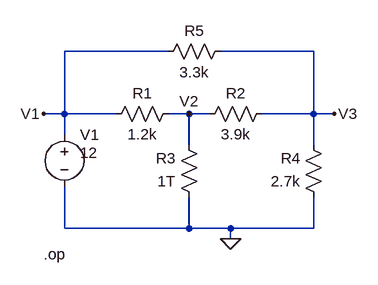
[diagram p0: schematic nodal8.asc]
nodal8.asc, the LTspice schematic file:
Version 4
SHEET 1 880 680
WIRE 144 16 -16 16
WIRE 368 16 224 16
WIRE -16 112 -16 16
WIRE -16 112 -48 112
WIRE 64 112 -16 112
WIRE 176 112 144 112
WIRE 208 112 176 112
WIRE 368 112 368 16
WIRE 368 112 288 112
WIRE 400 112 368 112
WIRE -16 144 -16 112
WIRE 176 160 176 112
WIRE 368 160 368 112
WIRE -16 288 -16 224
WIRE 176 288 176 240
WIRE 176 288 -16 288
WIRE 240 288 176 288
WIRE 368 288 368 240
WIRE 368 288 240 288
WIRE 240 304 240 288
FLAG 176 112 V2
FLAG 400 112 V3
FLAG 240 304 0
FLAG -48 112 V1
SYMBOL voltage -16 128 R0
WINDOW 3 24 44 Left 2
WINDOW 123 0 0 Left 0
WINDOW 39 0 0 Left 0
SYMATTR Value 12
SYMATTR InstName V1
SYMBOL res 160 96 R90
WINDOW 0 0 56 VBottom 2
WINDOW 3 32 56 VTop 2
SYMATTR InstName R1
SYMATTR Value 1.2k
SYMBOL res 304 96 R90
WINDOW 0 0 56 VBottom 2
WINDOW 3 32 56 VTop 2
SYMATTR InstName R2
SYMATTR Value 3.9k
SYMBOL res 192 256 R180
WINDOW 0 36 76 Left 2
WINDOW 3 36 40 Left 2
SYMATTR InstName R3
SYMATTR Value 1T
SYMBOL res 384 256 R180
WINDOW 0 36 76 Left 2
WINDOW 3 36 40 Left 2
SYMATTR InstName R4
SYMATTR Value 2.7k
SYMBOL res 128 32 R270
WINDOW 0 32 56 VTop 2
WINDOW 3 0 56 VBottom 2
SYMATTR InstName R5
SYMATTR Value 3.3k
TEXT -48 328 Left 2 !.op

The netlist it stands for:
* nodal8.asc
V1 V1 0 12
R1 V2 V1 1.2k
R2 V3 V2 3.9k
R3 0 V2 1T
R4 0 V3 2.7k
R5 V1 V3 3.3k
.op
.backanno
.end